# Altium schematic sheet prj1.SchDoc
size A0; SheetNumber: 1; SheetTotal: 1
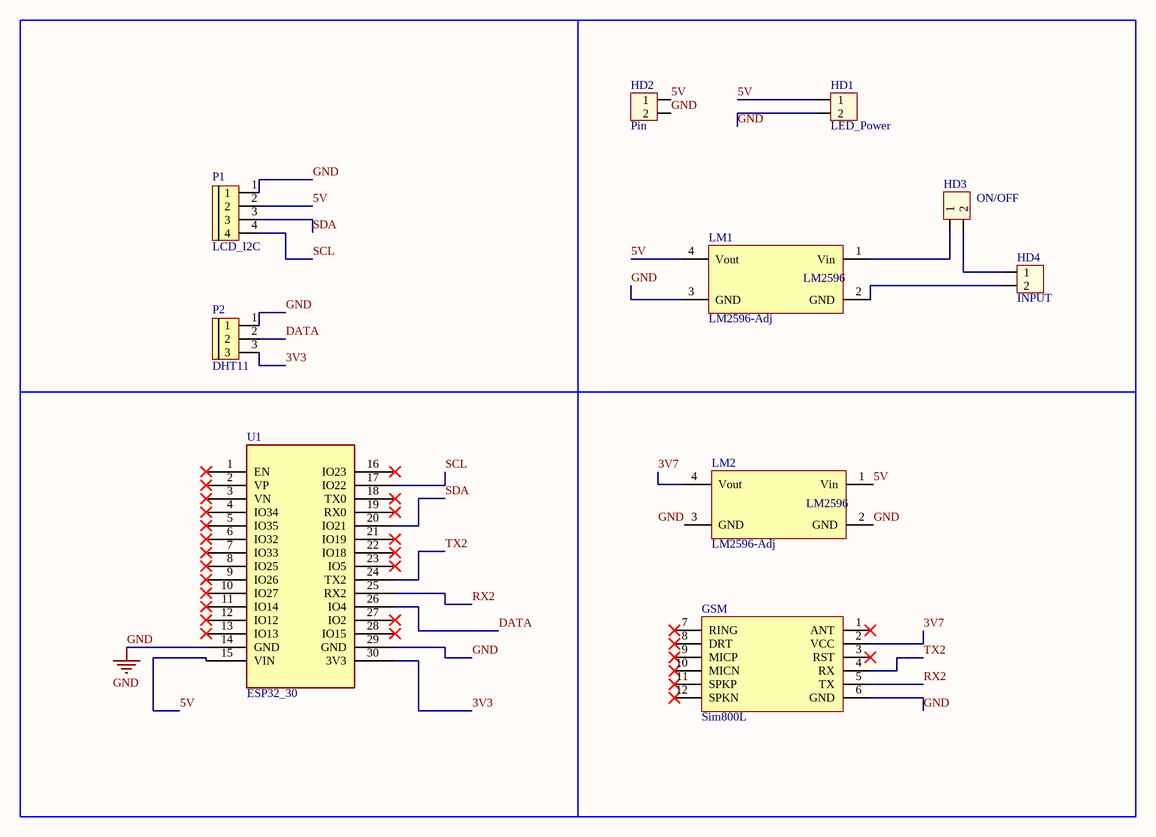
[diagram p0: prj1.SchDoc]

## Parts
GSM  Sim800L  [Sim800L]
HD1  LED_Power  [HED2]
HD2  Pin  [HED2]
HD3  ON/OFF  [HED2]
HD4  INPUT  [HED2]
LM1  LM2596-Adj  [lm2596]
LM2  LM2596-Adj  [lm2596]
P1  LCD_I2C  [CON 4 4EDG5.08]
P2  DHT11  [CON 3 3EDG5.08]
U1  ESP32_30  [ESP32_30]

## Nets
GND: GSM.6(GND) HD1.2 HD2.2 LM1.3(GND) LM2.2(GND) P1.1 P2.1 U1.14(GND) U1.29(GND)
3V3: P2.3 U1.30(3V3)
3V7: GSM.2(VCC) LM2.4(Vout)
5V: HD1.1 HD2.1 LM1.4(Vout) LM2.1(Vin) P1.2 U1.15(VIN)
DATA: P2.2 U1.26(IO4)
RX2: GSM.5(TX) U1.25(RX2)
SCL: P1.4 U1.17(IO22)
SDA: P1.3 U1.20(IO21)
TX2: GSM.4(RX) U1.24(TX2)
NetHD3_1: HD3.1 LM1.1(Vin)
NetHD3_2: HD3.2 HD4.1
NetHD4_2: HD4.2 LM1.2(GND)

Not connected (* = marked no-connect by the designer): GSM 1(ANT)* 3(RST)* 7(RING)* 8(DRT)* 9(MICP)* 10(MICN)* 11(SPKP)* 12(SPKN)*; LM2 3(GND); U1 1(EN)* 2(VP)* 3(VN)* 4(IO34)* 5(IO35)* 6(IO32)* 7(IO33)* 8(IO25)* 9(IO26)* 10(IO27)* 11(IO14)* 12(IO12)* 13(IO13)* 16(IO23)* 18(TX0)* 19(RX0)* 21(IO19)* 22(IO18)* 23(IO5)* 27(IO2)* 28(IO15)*

## Notes on the sheet
- Labels drawn without touching a wire or pin: GND
- (in symbol LM2596-Adj) LM2596

## Library data of the parts
HD1-HD4 = Hed2: Header 2 (Green); Value: Header 2
LM1 LM2 = LM2596-Adj: Designed By @Alixahedi
P1 = CON 4 EDG5.08: Cắm; Ten_Linh_Kien: CON 4 2EDG5.08-4P 5.08MM ( Xanh Cong); Don_Vi: Con; Ma_Hang: MH000979; Ghi_Chu: *; Kieu_Chan: *; Chung_Loai: Cắm
P2 = CON 3 EDG5.08: Cắm; Ten_Linh_Kien: CON 3 2EDG5.08-3P 5.08MM ( Xanh Cong); Don_Vi: Con; Ma_Hang: MH000760; Ghi_Chu: *; Kieu_Chan: *; Chung_Loai: Cắm
U1 = ESP32_30: Microcontoller Board 30 Pins Wifi 2.4GHz BLE 4.2 ESP32-WROOM-32D; ComponentLink1Description: Datasheet; ComponentLink1URL: https://www.mouser.com/datasheet/2/891/esp32_wroom_32d_esp32_wroom_32u_datasheet_en-1365844.pdf